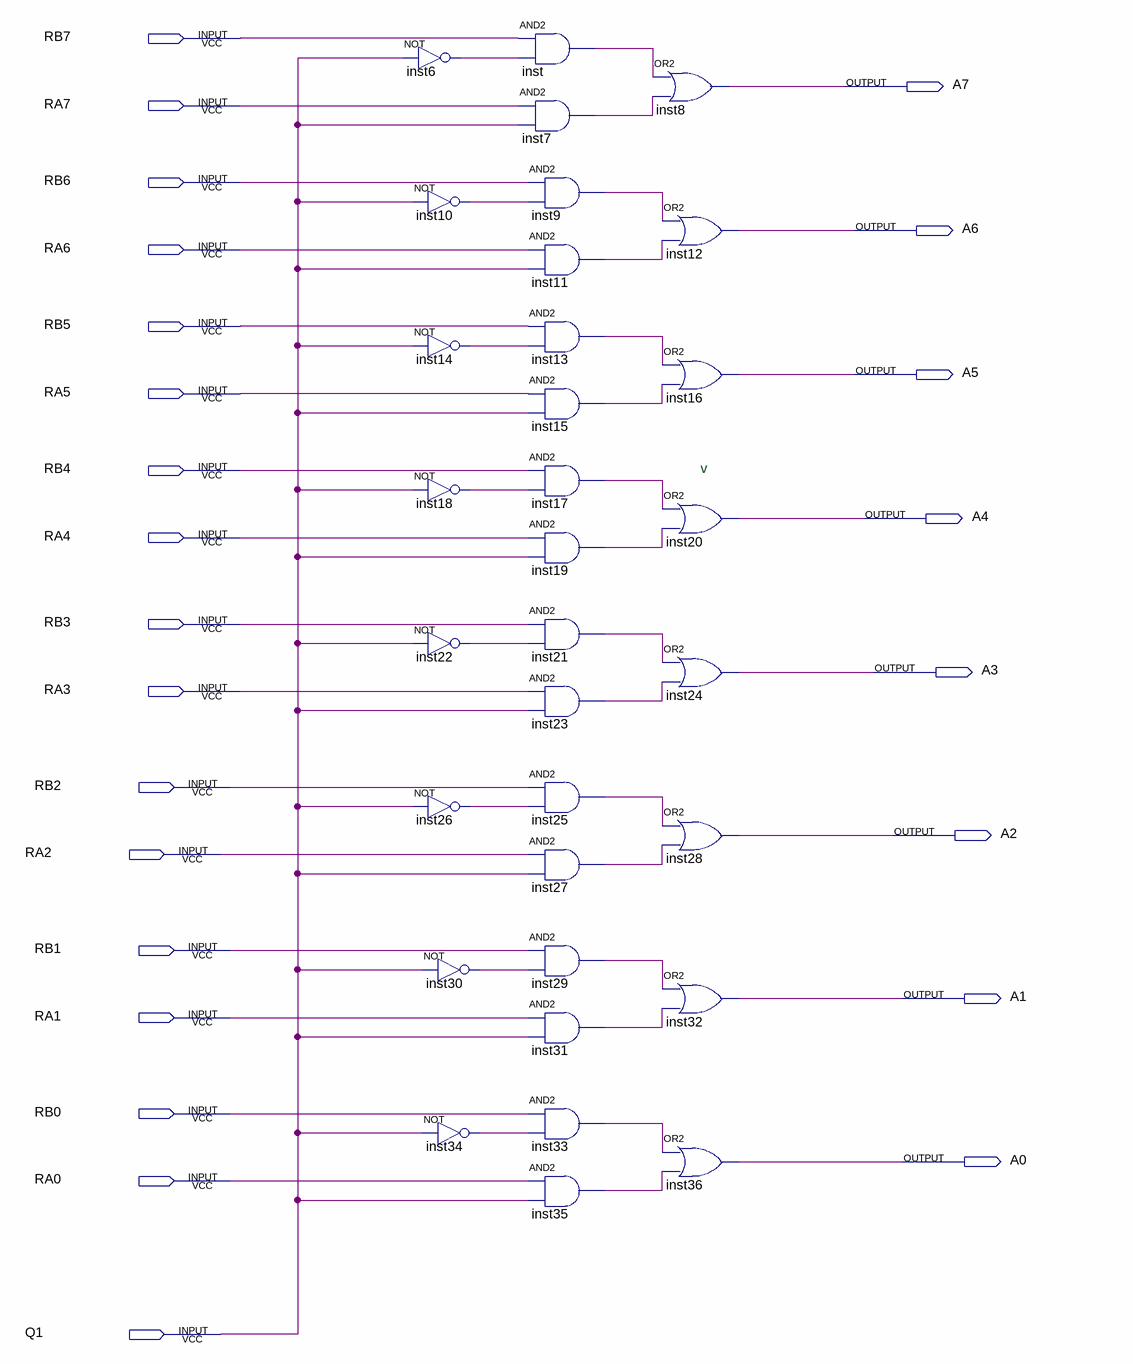
[diagram p0: schematic sheet]
// Quartus schematic choseR.bdf as structural Verilog: 32 symbols, 25 pins
module choseR (
  input  RB7,
  input  RA7,
  input  RB6,
  input  RA6,
  input  RB5,
  input  RA5,
  input  RB4,
  input  RA4,
  input  RB3,
  input  RA3,
  input  RB2,
  input  RA2,
  input  RB1,
  input  RA1,
  input  RB0,
  input  RA0,
  input  Q1,
  output A7,
  output A6,
  output A5,
  output A4,
  output A3,
  output A2,
  output A1,
  output A0
);

  wire inst6_out, inst7_out, inst9_out, inst10_out, inst11_out, inst13_out, inst14_out, inst15_out,
       inst17_out, inst18_out, inst19_out, inst21_out, inst22_out, inst23_out, inst25_out, inst26_out,
       inst27_out, inst29_out, inst30_out, inst31_out, inst33_out, inst34_out, inst35_out, inst_out;

  not inst6 (inst6_out, Q1);
  not inst10 (inst10_out, Q1);
  not inst14 (inst14_out, Q1);
  not inst18 (inst18_out, Q1);
  not inst22 (inst22_out, Q1);
  not inst26 (inst26_out, Q1);
  not inst30 (inst30_out, Q1);
  not inst34 (inst34_out, Q1);
  and inst (inst_out, RB7, inst6_out);
  and inst7 (inst7_out, RA7, Q1);
  and inst9 (inst9_out, RB6, inst10_out);
  and inst11 (inst11_out, RA6, Q1);
  and inst13 (inst13_out, RB5, inst14_out);
  and inst15 (inst15_out, RA5, Q1);
  and inst17 (inst17_out, RB4, inst18_out);
  and inst19 (inst19_out, RA4, Q1);
  and inst21 (inst21_out, RB3, inst22_out);
  and inst23 (inst23_out, RA3, Q1);
  and inst25 (inst25_out, RB2, inst26_out);
  and inst27 (inst27_out, RA2, Q1);
  and inst29 (inst29_out, RB1, inst30_out);
  and inst31 (inst31_out, RA1, Q1);
  and inst33 (inst33_out, RB0, inst34_out);
  and inst35 (inst35_out, RA0, Q1);
  or inst8 (A7, inst_out, inst7_out);
  or inst12 (A6, inst9_out, inst11_out);
  or inst16 (A5, inst13_out, inst15_out);
  or inst20 (A4, inst17_out, inst19_out);
  or inst24 (A3, inst21_out, inst23_out);
  or inst28 (A2, inst25_out, inst27_out);
  or inst32 (A1, inst29_out, inst31_out);
  or inst36 (A0, inst33_out, inst35_out);

  // Notes on the sheet:
  //   v
endmodule
